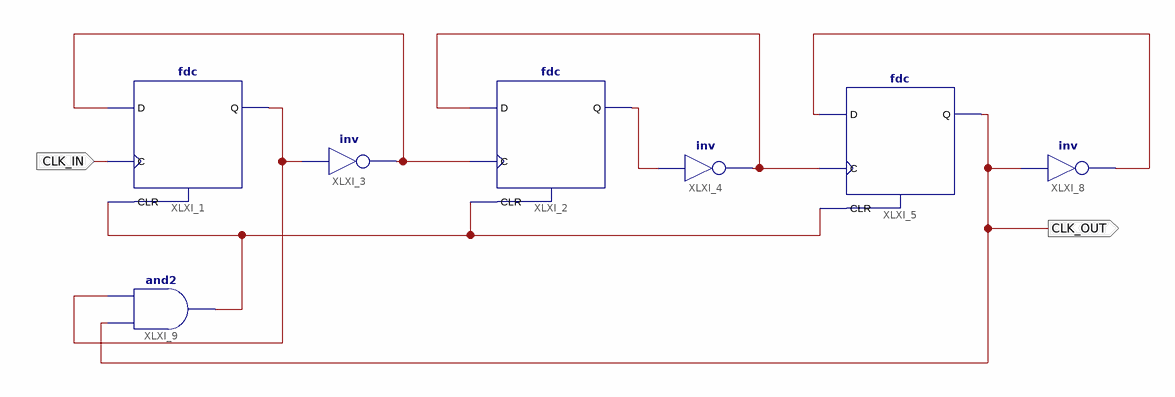
[diagram p0: schematic sheet 1]
// Xilinx ISE schematic CLK_DIV_5.sch (spartan6) as structural Verilog: 7 symbols, 2 ports
module CLK_DIV_5 (
  input  CLK_IN,
  output CLK_OUT
);

  wire XLXN_3, XLXN_11, XLXN_12, XLXN_14, XLXN_18, XLXN_26;

  fdc XLXI_1 (.C(CLK_IN), .CLR(XLXN_26), .D(XLXN_11), .Q(XLXN_3));
  fdc XLXI_2 (.C(XLXN_11), .CLR(XLXN_26), .D(XLXN_14), .Q(XLXN_12));
  not XLXI_3 (XLXN_11, XLXN_3);
  not XLXI_4 (XLXN_14, XLXN_12);
  fdc XLXI_5 (.C(XLXN_14), .CLR(XLXN_26), .D(XLXN_18), .Q(CLK_OUT));
  not XLXI_8 (XLXN_18, CLK_OUT);
  and XLXI_9 (XLXN_26, CLK_OUT, XLXN_3);
endmodule
